# Altium schematic sheet peripherals.SchDoc: Peripherals
size C; Organization: Altium Limited; Address1: L3, 12a Rodborough Rd; Address2: Frenchs Forest; Address3: NSW; Address4: Australia 2086; Revision: A; SheetNumber: 5; SheetTotal: 7
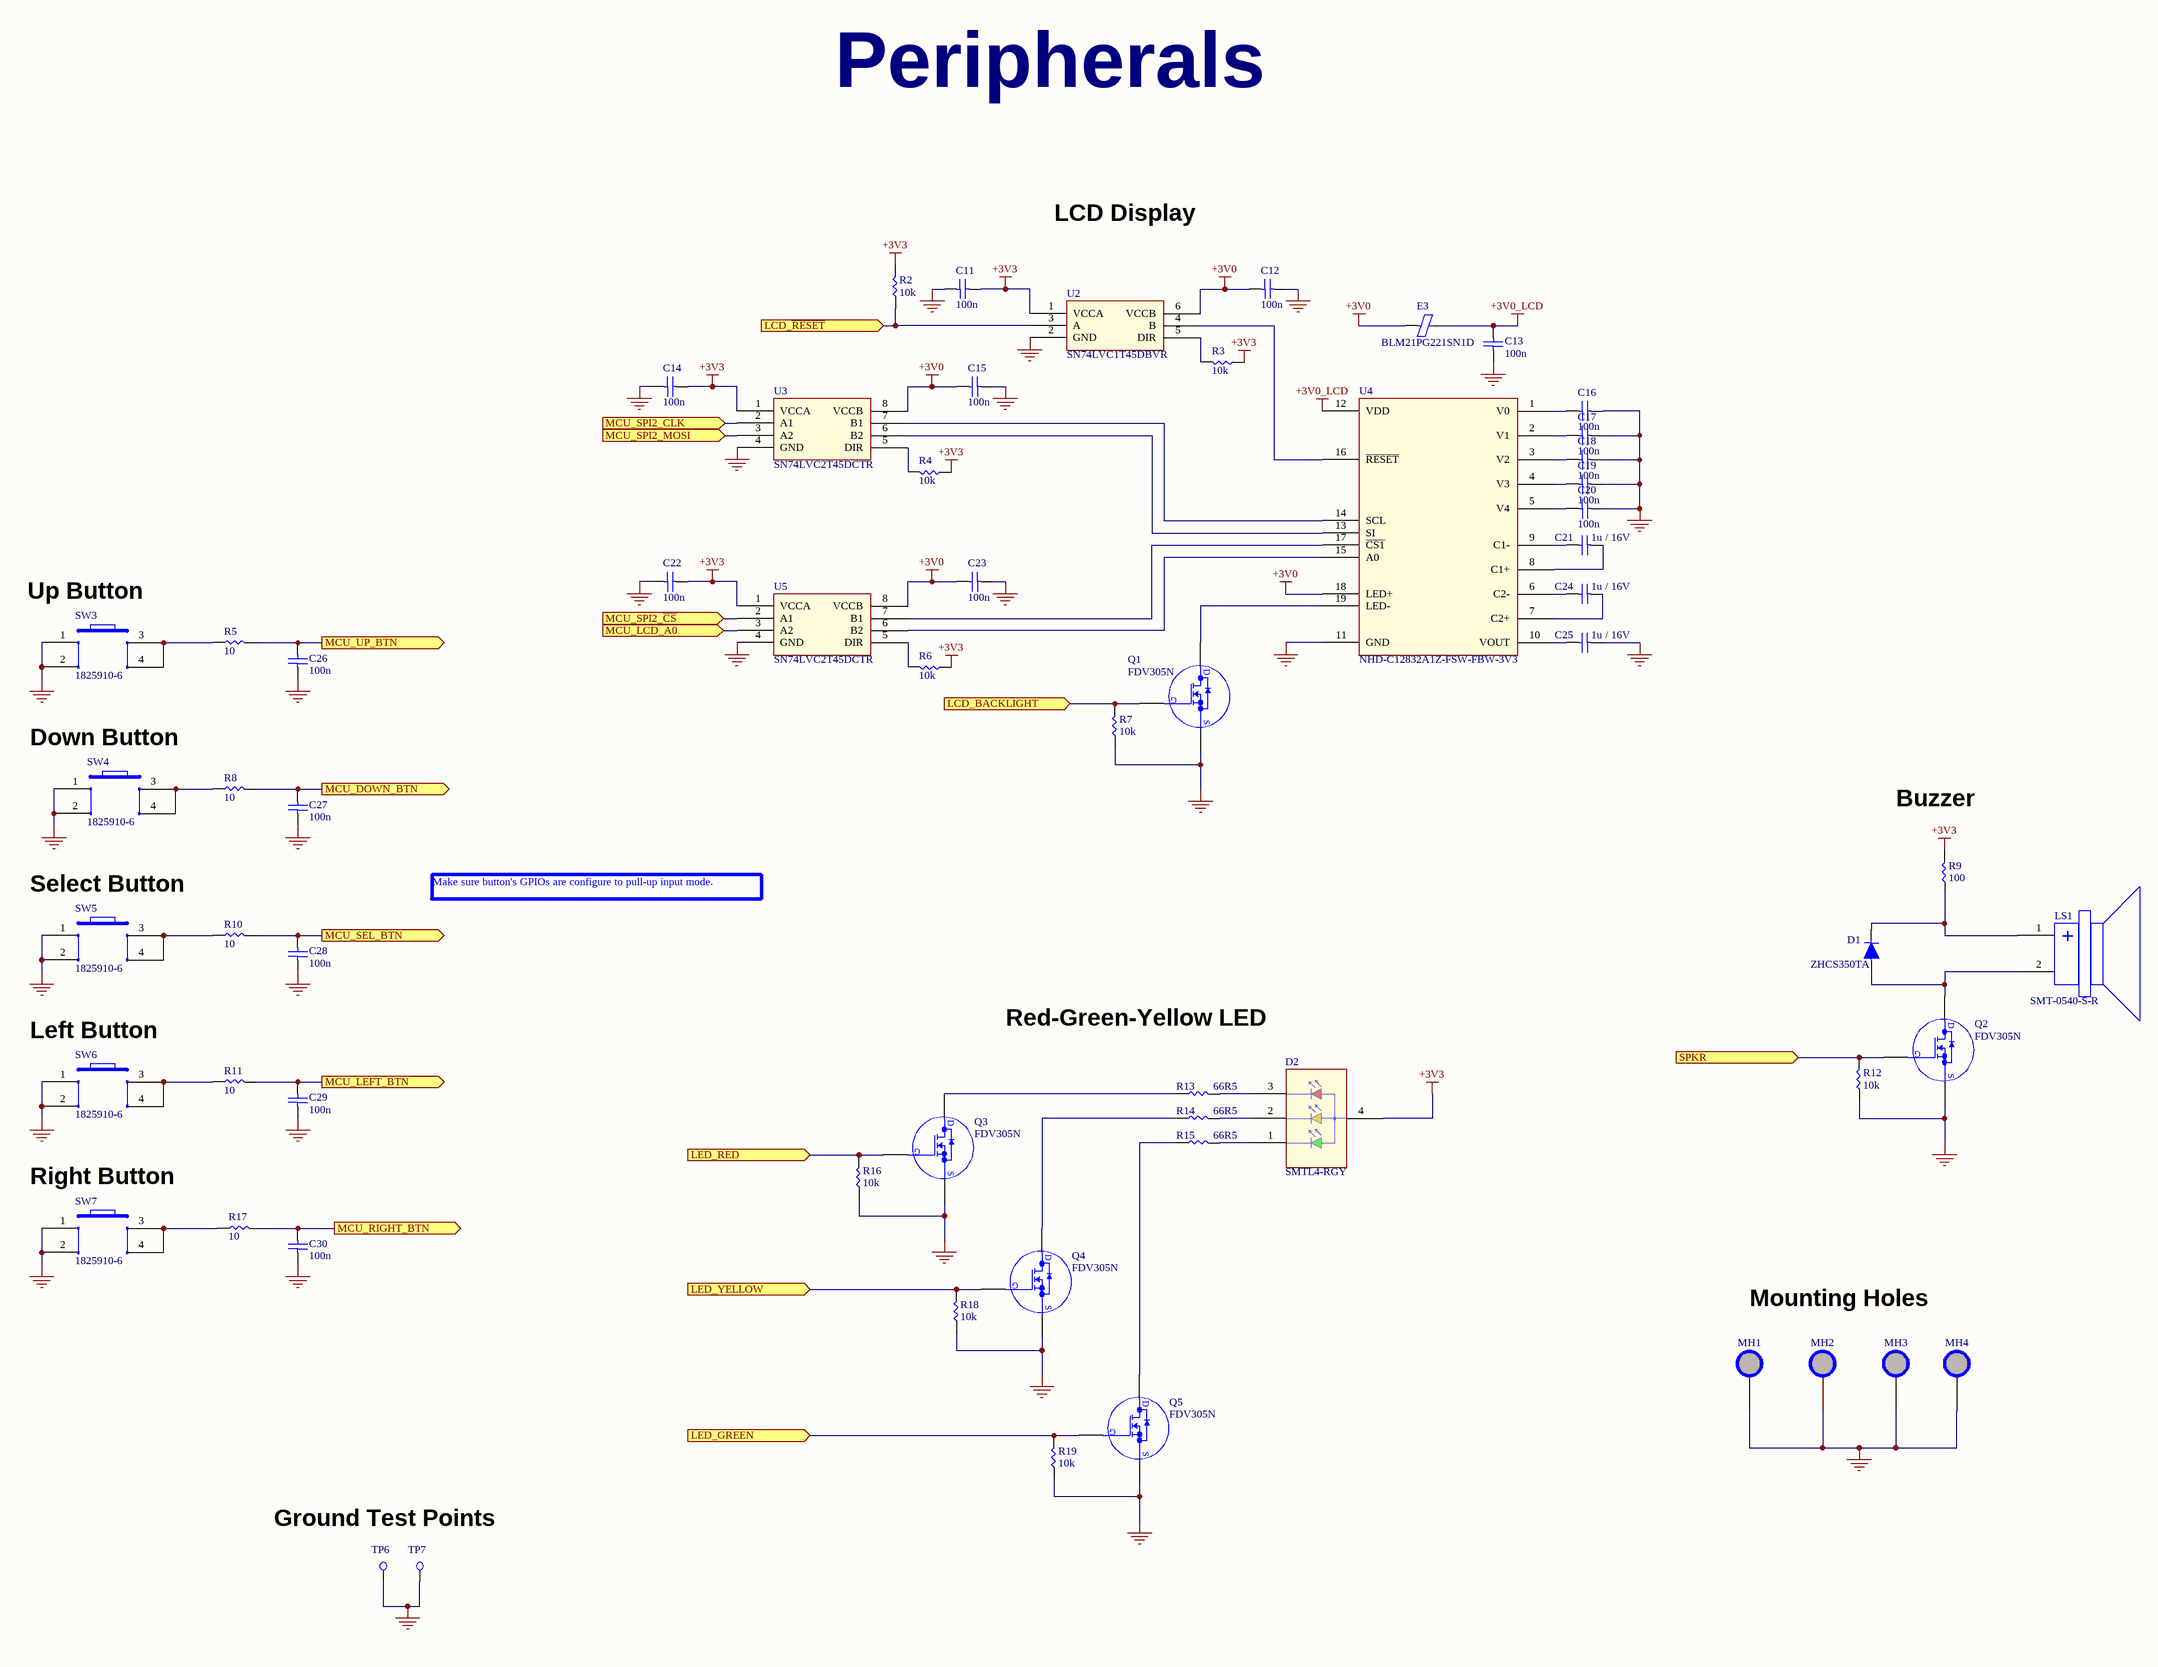
[diagram p0: peripherals.SchDoc]

## Parts
C11  100n  [C0402]
C12  100n  [C0402]
C13  100n  [C0402]
C14  100n  [C0402]
C15  100n  [C0402]
C16  100n  [C0402]
C17  100n  [C0402]
C18  100n  [C0402]
C19  100n  [C0402]
C20  100n  [C0402]
C21  1u / 16V  [C0805]
C22  100n  [C0402]
C23  100n  [C0402]
C24  1u / 16V  [C0805]
C25  1u / 16V  [C0805]
C26  100n  [C0402]
C27  100n  [C0402]
C28  100n  [C0402]
C29  100n  [C0402]
C30  100n  [C0402]
D1  ZHCS350TA  [DIODE_SOD-523]
D2  SMTL4-RGY  [SMTL4-RGY]
E3  BLM21PG221SN1D  [R0805]
LS1  SMT-0540-S-R  [SMT-0540-S-R]
MH1  Mounting Hole 7.4mm, 3.2mm  [MH_7.4mm_3.2mm]  (value not drawn)  (no BOM)
MH2  Mounting Hole 7.4mm, 3.2mm  [MH_7.4mm_3.2mm]  (value not drawn)  (no BOM)
MH3  Mounting Hole 7.4mm, 3.2mm  [MH_7.4mm_3.2mm]  (value not drawn)  (no BOM)
MH4  Mounting Hole 7.4mm, 3.2mm  [MH_7.4mm_3.2mm]  (value not drawn)  (no BOM)
Q1  FDV305N  [FDV305N_SOT-23-3]
Q2  FDV305N  [FDV305N_SOT-23-3]
Q3  FDV305N  [FDV305N_SOT-23-3]
Q4  FDV305N  [FDV305N_SOT-23-3]
Q5  FDV305N  [FDV305N_SOT-23-3]
R2  10k  [R0805]
R3  10k  [R0805]
R4  10k  [R0805]
R5  10  [R0402]
R6  10k  [R0805]
R7  10k  [R0805]
R8  10  [R0402]
R9  100  [R0805]
R10  10  [R0402]
R11  10  [R0402]
R12  10k  [R0805]
R13  66R5  [R0805]
R14  66R5  [R0805]
R15  66R5  [R0805]
R16  10k  [R0805]
R17  10  [R0402]
R18  10k  [R0805]
R19  10k  [R0805]
SW3  1825910-6  [1825910-6]
SW4  1825910-6  [1825910-6]
SW5  1825910-6  [1825910-6]
SW6  1825910-6  [1825910-6]
SW7  1825910-6  [1825910-6]
TP6  Test Pad 1mm  [TP_1MM]  (value not drawn)  (no BOM)
TP7  Test Pad 1mm  [TP_1MM]  (value not drawn)  (no BOM)
U2  SN74LVC1T45DBVR  [SOT-23-6]
U3  SN74LVC2T45DCTR  [SOP8]
U4  NHD-C12832A1Z-FSW-FBW-3V3  [NHD-C12832A1Z-FSW-FBW-3V3]
U5  SN74LVC2T45DCTR  [SOP8]

## Ports
LCD_BACKLIGHT (in), LCD_~{RESET} (in), LED_GREEN (in), LED_RED (in), LED_YELLOW (in), MCU_DOWN_BTN (out), MCU_LCD_A0 (in), MCU_LEFT_BTN (out), MCU_RIGHT_BTN (out), MCU_SEL_BTN (out), MCU_SPI2_CLK (in), MCU_SPI2_MOSI (in), MCU_SPI2_~{CS} (in), MCU_UP_BTN (out), SPKR (in)

## Nets
+3V0: C12.1 C15.2 C23.2 E3.1 U2.6(VCCB) U3.8(VCCB) U4.18(LED+) U5.8(VCCB)
+3V0_LCD: C13.2 E3.2 U4.12(VDD)
+3V3: C11.2 C14.2 C22.2 D2.4(COMMON_ANODE) R2.2 R3.1 R4.1 R6.1 R9.2 U2.1(VCCA) U3.1(VCCA) U5.1(VCCA)
GND: C11.1 C12.2 C13.1 C14.1 C15.1 C16.2 C17.2 C18.2 C19.2 C20.2 C22.1 C23.1 C25.1 C26.1 C27.1 C28.1 C29.1 C30.1 MH1.1 MH2.1 MH3.1 MH4.1 Q1.2(S) Q2.2(S) Q3.2(S) Q4.2(S) Q5.2(S) R7.1 R12.1 R16.1 R18.1 R19.1 SW3.1 SW3.2 SW4.1 SW4.2 SW5.1 SW5.2 SW6.1 SW6.2 SW7.1 SW7.2 TP6.1 TP7.1 U2.2(GND) U3.4(GND) U4.11(GND) U5.4(GND)
LCD_BACKLIGHT: Q1.1(G) R7.2 ; port LCD_BACKLIGHT
LCD_~{RESET}: R2.1 U2.3(A) ; port LCD_~{RESET}
LED_GREEN: Q5.1(G) R19.2 ; port LED_GREEN
LED_RED: Q3.1(G) R16.2 ; port LED_RED
LED_YELLOW: Q4.1(G) R18.2 ; port LED_YELLOW
MCU_DOWN_BTN: C27.2 R8.2 ; port MCU_DOWN_BTN
MCU_LCD_A0: U5.3(A2) ; port MCU_LCD_A0
MCU_LEFT_BTN: C29.2 R11.2 ; port MCU_LEFT_BTN
MCU_RIGHT_BTN: C30.2 R17.2 ; port MCU_RIGHT_BTN
MCU_SEL_BTN: C28.2 R10.2 ; port MCU_SEL_BTN
MCU_SPI2_~{CS}: U5.2(A1) ; port MCU_SPI2_~{CS}
MCU_SPI2_CLK: U3.2(A1) ; port MCU_SPI2_CLK
MCU_SPI2_MOSI: U3.3(A2) ; port MCU_SPI2_MOSI
MCU_UP_BTN: C26.2 R5.2 ; port MCU_UP_BTN
SPKR: Q2.1(G) R12.2 ; port SPKR
NetC16_1: C16.1 U4.1(V0)
NetC17_1: C17.1 U4.2(V1)
NetC18_1: C18.1 U4.3(V2)
NetC19_1: C19.1 U4.4(V3)
NetC20_1: C20.1 U4.5(V4)
NetC21_1: C21.1 U4.8(C1+)
NetC21_2: C21.2 U4.9(C1-)
NetC24_1: C24.1 U4.7(C2+)
NetC24_2: C24.2 U4.6(C2-)
NetC25_2: C25.2 U4.10(VOUT)
NetD1_1: D1.1(A) LS1.2(+) Q2.3(D)
NetD1_2: D1.2(K) LS1.1(+) R9.1
NetD2_1: D2.1(GREEN_CATHODE) R15.2
NetD2_2: D2.2(YELLOW_CATHODE) R14.2
NetD2_3: D2.3(RED_CATHODE) R13.2
NetQ1_3: Q1.3(D) U4.19(LED-)
NetQ3_3: Q3.3(D) R13.1
NetQ4_3: Q4.3(D) R14.1
NetQ5_3: Q5.3(D) R15.1
NetR3_2: R3.2 U2.5(DIR)
NetR4_2: R4.2 U3.5(DIR)
NetR5_1: R5.1 SW3.3 SW3.4
NetR6_2: R6.2 U5.5(DIR)
NetR8_1: R8.1 SW4.3 SW4.4
NetR10_1: R10.1 SW5.3 SW5.4
NetR11_1: R11.1 SW6.3 SW6.4
NetR17_1: R17.1 SW7.3 SW7.4
NetU2_4: U2.4(B) U4.16(~{RESET})
NetU3_6: U3.6(B2) U4.13(SI)
NetU3_7: U3.7(B1) U4.14(SCL)
NetU4_15: U4.15(A0) U5.6(B2)
NetU4_17: U4.17(~{CS1}) U5.7(B1)

## Notes on the sheet
- Peripherals
- LCD Display
- (near SW3) Up Button
- Down Button
- Buzzer
- Select Button
- Make sure button's GPIOs are configure to pull-up input mode.
- Left Button
- Red-Green-Yellow LED
- Right Button
- Mounting Holes
- Ground Test Points
- Title:
- Size:
- Date:
- File:
- C
- Number:
- Revision:
- Sheet
- of
- https://github.com/barakgut
- Github:

## Library data of the parts
C11-C20 C22 C23 C26-C30 = CGA2B3X7R1E104K050BB: TDK         CGA2B3X7R1E104K050BB             SMD Multilayer Ceramic Capacitor, 0402 [1005 Metric], 0.1 F, 25 V,  10%, X7R, CGA Series; PCN Part Number: MLCC Part Number Change 30/Nov/2012; Capacitance: 0.1µF; Product Training Modules: CGA Series for Automotive Applications SEAT, CCV, and TVCL Design Tools Guide to Replacing an Electrolytic Capacitor with an MLCC; Featured Product: CGA Series MLCC Capacitors; Voltage - Rated: 25V; Online Catalog: CGA Series, Automotive General, Mid and High Voltage; Other Names: 445-6902-6; Supplier 1: Digi-Key; Supplier Part Number 1: 445-6902-1-ND; Manufacturer: TDK; Stock 1: 100000; Pricing 1: 1=0.16, 10=0.115, 100=0.054, 500=0.0379, 1000=0.0314, 2500=0.0292, 5000=0.0267 (USD); Package / Case: 0402 (1005 Metric); Packaging: Digi-Reel®; RoHS Information: RoHS Certificate-MLCC; Standard Package: 1; Category: Capacitors; Family: Ceramic Capacitors; Series: CGA; Tolerance: ±10%; Temperature Coefficient: X7R; Mounting Type: Surface Mount, MLCC; Operating Temperature: -55°C ~ 125°C; Applications: Automotive; Ratings: AEC-Q200; Size / Dimension: 0.039" L x 0.020" W (1.00mm x 0.50mm); Height - Seated (Max): -; Thickness (Max): 0.022" (0.55mm); Lead Spacing: -; Features: -; Lead Style: -; ComponentLink1URL: http://www.farnell.com/datasheets/1735392.pdf; ComponentLink1Description: http://www.farnell.com/datasheets/1735392.pdf; ComponentLink2URL: http://www.mouser.com/ds/2/400/lcc_automotive_general_en-843974.pdf; ComponentLink2Description: http://www.mouser.com/ds/2/400/lcc_automotive_general_en-843974.pdf; Manufacturer Part Number: CGA2B3X7R1E104K050BB
C21 C24 C25 = C0805C105K4RAC7800: Multilayer Ceramic Capacitors MLCC - SMD/SMT 16volts 1uF X7R 10%; Manufacturer: KEMET; Rad Hard: No; Voltage: 16 Vdc; Product Length: 2 mm; Product Height: 0.9 mm; Product Depth: 1.25 mm; Supplier 1: Digi-Key; Supplier Part Number 1: 399-1284-1-ND; Stock 1: 40000; Pricing 1: 1=0.17, 10=0.124, 100=0.0581, 500=0.0408, 1000=0.0337 (USD); Package/Case: 0805; Mounting: Surface Mount; Capacitance Value: 1 uF; Tolerance: 10 %; Dielectric: X7R; Operating Temperature: -55 to 125 °C; Construction: Flat; Category: Capacitor Ceramic Multilayer; Manufacturer Part Number: C0805C105K4RAC7800
D1 = ZHCS350TA: DIODE SCHOTTKY 40V 350MA SOD523; Manufacturer: Diodes Zetex; If - Forward Current: 0.51 A; Vf - Forward Voltage: 0.81 V at 0.35 A; Ifsm - Forward Surge Current: 4.2 A; Configuration: Single; Ir - Reverse Current: 12 uA at 30 V; Brand: Diodes Incorporated; trr - Reverse Recovery time: 1.6 ns; Type: Schottky Diode; Unit Weight: 0.000035 oz; Supplier 1: Digi-Key; Supplier Part Number 1: ZHCS350TACT-ND; Stock 1: 263997; Pricing 1: 1=0.45, 10=0.382, 100=0.2855, 500=0.2243, 1000=0.1734 (USD); Product Category: Schottky Diodes & Rectifiers; RoHS: True; Product: Schottky Diodes; Mounting Style: SMD/SMT; Package / Case: SOD-523; Vrrm - Repetitive Reverse Voltage: 40 V; Technology: Si; Maximum Operating Temperature: + 125 C; Minimum Operating Temperature: - 55 C; Series: ZHCS350; Packaging: Reel; Height: 0.8 mm; Length: 1.3 mm; Operating Temperature Range: + 125 C; Factory Pack Quantity: 3000; Termination Style: SMD/SMT; Width: 0.9 mm; ComponentLink1URL: http://www.farnell.com/datasheets/2238072.pdf; ComponentLink1Description: http://www.farnell.com/datasheets/2238072.pdf; ComponentLink2URL: http://www.diodes.com/datasheets/ZHCS350.pdf; ComponentLink2Description: http://www.diodes.com/datasheets/ZHCS350.pdf; ComponentLink3URL: http://www.farnell.com/datasheets/13262.pdf; ComponentLink3Description: http://www.farnell.com/datasheets/13262.pdf; ComponentLink4URL: http://www.diodes.com///datasheets/ZHCS350.pdf; ComponentLink4Description: http://www.diodes.com///datasheets/ZHCS350.pdf; ComponentLink5URL: https://www.diodes.com/assets/Datasheets/ZHCS350.pdf; ComponentLink5Description: https://www.diodes.com/assets/Datasheets/ZHCS350.pdf; ComponentLink6URL: http://www.mouser.com/ds/2/115/ZHCS350-93341.pdf; ComponentLink6Description: http://www.mouser.com/ds/2/115/ZHCS350-93341.pdf; Manufacturer Part Number: ZHCS350TA
D2 = SMTL4-RGY: Green, Red, Yellow 570nm Green, 640nm Red, 585nm Yellow LED Indication - Discrete 1.9V Green, 1.85V Red, 1.9V Yellow 4-PLCC; Manufacturer: Bivar; Lens Color: Colorless; Lens Transparency: Clear; Millicandela Rating: 40mcd Green, 36mcd Red, 16mcd Yellow; Lens Style/Size: Round with Flat Top, 2.40mm; Current - Test: 20mA Green, 20mA Red, 20mA Yellow; Viewing Angle: 120°; Supplier 1: Digi-Key; Supplier Part Number 1: 492-2173-1-ND; Stock 1: 53898; Pricing 1: 1=1.65, 10=1.338, 25=1.0296, 100=0.9266, 250=0.8237, 500=0.7001, 1000=0.5766 (USD); Category: Optoelectronics; Family: LED Indication - Discrete; Series: -; Packaging: Tape & Reel (TR); Part Status: Active; Color: Green, Red, Yellow; Voltage - Forward (Vf) (Typ): 1.9V Green, 1.85V Red, 1.9V Yellow; Mounting Type: Surface Mount; Wavelength - Dominant: 570nm Green, 640nm Red, 585nm Yellow; Wavelength - Peak: -; Features: -; Package / Case: 4-PLCC; Supplier Device Package: 4-PLCC; Size / Dimension: 3.20mm L x 2.80mm W; Height (Max): 2.05mm; Manufacturer Part Number: SMTL4-RGY
E3 = BLM21PG221SN1D: FERRITE CHIP 220 OHM 0805; Manufacturer: Murata; Product Training Modules: Ferrite Beads and Arrays; Catalog Drawings: BLM21 Series Side BLM21 Series Top; EDA / CAD Models: Download from Accelerated Designs; Filter Type: Power Line; Number of Lines: 1; Impedance @ Frequency: 220 Ohm @ 100MHz; Current Rating (Max): 2A; DC Resistance (DCR) (Max): 45 mOhm; Online Catalog: EMIFIL® BLM21P Series; Other Names: 490-1054-6; Supplier 1: Digi-Key; Supplier Part Number 1: 490-1054-1-ND; Stock 1: 1796179; Pricing 1: 1=0.1, 10=0.081, 25=0.0732, 50=0.0538, 100=0.0464, 250=0.0366, 500=0.0309, 1000=0.0261 (USD); Standard Package: 1; Category: Filters; Family: Ferrite Beads and Chips; Series: BLM21P; Packaging: Digi-Reel®; Ratings: -; Operating Temperature: -55°C ~ 125°C; Package / Case: 0805 (2012 Metric); Mounting Type: Surface Mount; Height (Max): 0.041" (1.05mm); Size / Dimension: 0.079" L x 0.049" W (2.00mm x 1.25mm); Manufacturer Part Number: BLM21PG221SN1D
LS1 = SMT-0540-S-R: BUZZER MAGNETIC 3V 5MM SMD; Manufacturer: Projects Unlimited; Frequency: 4 kHz; Sound Pressure Level: 78 dBA; Shape: Square; Brand: PUI Audio; Supplier 1: Digi-Key; Supplier Part Number 1: 668-1060-1-ND; Stock 1: 22701; Pricing 1: 1=3.13, 10=2.476, 25=2.2596, 50=2.1106, 100=1.9619, 250=1.7995, 500=1.6913 (USD); Product Category: Speakers & Transducers; RoHS: True; Product: Transducers; Type: Electromagnetic; Termination Style: Gullwing Lead; Length: 5 mm; Width: 5 mm; Depth: 2 mm; Length - in: 0.197 in; Length - mm: 5 mm; Operating Temperature Range: - 40 C to + 85 C; Packaging: Reel; Factory Pack Quantity: 2000; Width - in: 0.197 in; Width - mm: 5 mm; ComponentLink1URL: http://www.mouser.com/ds/2/334/SMT-0540-S-R-44003.pdf; ComponentLink1Description: http://www.mouser.com/ds/2/334/SMT-0540-S-R-44003.pdf; ComponentLink2URL: http://www.puiaudio.com/pdf/SMT-0540-S-R.pdf; ComponentLink2Description: http://www.puiaudio.com/pdf/SMT-0540-S-R.pdf; ComponentLink3URL: http://www.farnell.com/datasheets/1916494.pdf; ComponentLink3Description: http://www.farnell.com/datasheets/1916494.pdf; Manufacturer Part Number: SMT-0540-S-R
MH1-MH4 = MOUNT_HOLE_7.4mm_3.2mm
Q1-Q5 = FDV305N: MOSFET N-CH 20V 0.9A SOT-23; Manufacturer: ON Semiconductor / Fairchild; Channel Type: N; Maximum Drain Source Resistance: 0.22 Ω; Minimum Gate Threshold Voltage: 0.6V; Maximum Gate Source Voltage: ±12 V; Transistor Configuration: Single; Channel Mode: Enhancement; Maximum Power Dissipation: 0.35 W; Typical Gate Charge @ Vgs: 1.1 nC @ 4.5 V; Typical Turn-Off Delay Time: 8 ns; Number of Elements per Chip: 1; Transistor Material: Si; Typical Turn-On Delay Time: 4.5 ns; Typical Input Capacitance @ Vds: 109 pF@ 10 V; Supplier 1: Digi-Key; Supplier Part Number 1: FDV305NCT-ND; Stock 1: 113719; Pricing 1: 1=0.43, 10=0.341, 100=0.234, 500=0.1604, 1000=0.1203 (USD); Maximum Continuous Drain Current: 0.9 A; Maximum Drain Source Voltage: 20 V; Package Type: SOT-23; Mounting Type: Surface Mount; Pin Count: 3; Category: Power MOSFET; Maximum Operating Temperature: +150 °C; Length: 2.92mm; Dimensions: 2.92 x 1.3 x 0.93mm; Width: 1.3mm; Minimum Operating Temperature: -55 °C; Height: 0.93mm; ComponentLink1URL: http://www.jameco.com/Jameco/Products/ProdDS/899087.pdf; ComponentLink1Description: http://www.jameco.com/Jameco/Products/ProdDS/899087.pdf; ComponentLink2URL: http://www.mouser.com/ds/2/149/FDV305N-79611.pdf; ComponentLink2Description: http://www.mouser.com/ds/2/149/FDV305N-79611.pdf; ComponentLink3URL: https://www.fairchildsemi.com/package-drawings/MA/MA03B.pdf; ComponentLink3Description: https://www.fairchildsemi.com/package-drawings/MA/MA03B.pdf; ComponentLink4URL: http://www.farnell.com/datasheets/184807.pdf; ComponentLink4Description: http://www.farnell.com/datasheets/184807.pdf; ComponentLink5URL: http://www.fairchildsemi.com/ds/FD/FDV305N.pdf; ComponentLink5Description: http://www.fairchildsemi.com/ds/FD/FDV305N.pdf; ComponentLink6URL: https://www.fairchildsemi.com/datasheets/FD/FDV305N.pdf; ComponentLink6Description: https://www.fairchildsemi.com/datasheets/FD/FDV305N.pdf; Manufacturer Part Number: FDV305N
R2-R4 R6 R7 R12 R16 R18 R19 = RC0805FR-0710KL: RES SMD 10K OHM 1% 1/8W 0805; Manufacturer: Yageo; Resistance: 10 kOhms; Power Rating: 125 mW (1/8 W); Voltage Rating: 150 V; Temperature Coefficient: 100 PPM / C; Supplier 1: Digi-Key; Supplier Part Number 1: 311-10.0KCRCT-ND; Stock 1: 31531286; Pricing 1: 1=0.1, 10=0.046, 100=0.0186, 1000=0.0084, 2500=0.0073 (USD); Termination Style: SMD/SMT; Product: Thick Film Resistors General Purpose; Tolerance: 1 %; Case Code - in: 0805; Case Code - mm: 2012; Series: RC; Operating Temperature Range: - 55 C to + 155 C; Packaging: Reel; Manufacturer Part Number: RC0805FR-0710KL
R5 R8 R10 R11 R17 = RC0402FR-0710RL: RES SMD 10 OHM 1% 1/16W 0402; Manufacturer: Yageo; Resistance: 10 Ohms; Power Rating: 62.5 mW (1/16 W); Temperature Coefficient: 100 PPM / C; Voltage Rating: 50 V; Supplier 1: Digi-Key; Supplier Part Number 1: 311-10.0LRCT-ND; Stock 1: 1306139; Pricing 1: 1=0.1, 10=0.027, 100=0.0111, 1000=0.005, 2500=0.0043, 5000=0.0036 (USD); Case Code - in: 0402; Case Code - mm: 1005; Operating Temperature Range: - 55 C to + 155 C; Packaging: Reel; Product: Thick Film Resistors General Purpose; Series: RC; Termination Style: SMD/SMT; Tolerance: 1 %; Manufacturer Part Number: RC0402FR-0710RL; ComponentLink1URL: http://www.farnell.com/datasheets/1018594.pdf; ComponentLink1Description: http://www.farnell.com/datasheets/1018594.pdf; ComponentLink2URL: https://www.verical.com/server-webapp/html/getDatasheet?partID=323697; ComponentLink2Description: https://www.verical.com/server-webapp/html/getDatasheet?partID=323697
R9 = RT0805FRE07100RL: RES SMD 100 OHM 1% 1/8W 0805; Manufacturer: Yageo; Resistance: 100 Ohms; Power Rating: 125 mW (1/8 W); Temperature Coefficient: 50 PPM / C; Voltage Rating: 150 V; Unit Weight: 0.000194 oz; Supplier 1: Digi-Key; Supplier Part Number 1: YAG3360CT-ND; Stock 1: 7; Pricing 1: 1=0.11, 10=0.097, 100=0.0375, 1000=0.0165, 2500=0.0142 (USD); Product Category: Thin Film Resistors; RoHS: True; Brand: Yageo; Tolerance: 1 %; Case Code - in: 0805; Case Code - mm: 2012; Operating Temperature Range: - 55 C to + 125 C; Series: RT; Packaging: Reel; Height: 0.5 mm; Length: 2 mm; Package / Case: 0805 (2012 metric); Product: Thin Film Resistors SMD; Termination Style: SMD/SMT; Type: High Precision, High Stability; Width: 1.2 mm; ComponentLink1URL: http://www.yageo.com/NewPortal/yageodocoutput?fileName=/pdf/R-Chip/PYu-RT_1-to-0.05_RoHS_L_5.pdf; ComponentLink1Description: http://www.yageo.com/NewPortal/yageodocoutput?fileName=/pdf/R-Chip/PYu-RT_1-to-0.05_RoHS_L_5.pdf; ComponentLink2URL: http://www.mouser.com/ds/2/447/yageodocoutput-1125656.pdf; ComponentLink2Description: http://www.mouser.com/ds/2/447/yageodocoutput-1125656.pdf; ComponentLink3URL: http://www.farnell.com/datasheets/442970.pdf; ComponentLink3Description: http://www.farnell.com/datasheets/442970.pdf; Manufacturer Part Number: RT0805FRE07100RL
R13-R15 = RC0805FR-0766R5L: Thick Film Resistors - SMD 66.5 OHM 1%; Manufacturer: Yageo; Case Height: 0.5 mm; Case Length: 2 mm; Case Width: 1.25 mm; Power Rating: 125 mW (1/8 W); Resistance: 66.5 Ohms; Temperature Coefficient: 100 PPM / C; Voltage Rating: 150 V; Supplier 1: Digi-Key; Supplier Part Number 1: 311-66.5CRCT-ND; Stock 1: 162629; Pricing 1: 1=0.1, 10=0.056, 100=0.0228, 1000=0.0102, 2500=0.0089 (USD); Brand: Yageo; Case Code - in: 0805; Case Code - mm: 2012; Dimensions: 1.25 mm W x 2 mm L x 0.5 mm H; Product Category: Thick Film Resistors - SMD; Operating Temperature Range: - 55 C to + 155 C; Package / Case: 0805 (2012 metric); Packaging: Reel; Product: Thick Film Resistors General Purpose; Termination Style: SMD/SMT; RoHS: Details; Tolerance: 1 %; Series: RC; Type: General Purpose Chip Resistor Surface Mount; Manufacturer Part Number: RC0805FR-0766R5L
SW3-SW7 = 1825910-6: Switch Push Button OFF (ON) SPST Round Button 0.05A 24VDC Momentary Contact PC Pins Thru-Hole; Manufacturer: TE Connectivity Alcoswitch; Actuator Color: Black; Actuator Length: 1.4 mm; Actuator Material: Polybutylene Terephthalate; Body Orientation: Straight; Bushing Type: Unthreaded; Electrical Life: 100000 Cycles; Dielectric Strength: 500 VAC; Contact Rating @ Voltage: 0.05A@24VDC; Maximum DC Voltage Rating: 24 V; Maximum Contact Resistance: 100 mOhm; Illumination: N/R; Supplier 1: Digi-Key; Supplier Part Number 1: 450-1650-ND; Stock 1: 75696; Pricing 1: 1=0.1, 10=0.093, 25=0.0892, 50=0.0862, 100=0.0814, 250=0.0766, 500=0.0734, 1000=0.0558, 5000=0.0463 (USD); Base Material: N/A; Actuator Style: Round Button; Family: 1825910; Contact Material: Copper Alloy; Contact Plating: Silver; Dimension: 5.99 x 5 mm; Part No: 1825910-6; RoHS: Yes; Function: Momentary Contact; Maximum AC Voltage Rating: N/A; Pole Throw Configuration: SPST; Mechanical Life: 100000 Cycles; Packaging: N/A; Housing Material: N/A; Product Weight: N/A; Mounting: Through Hole; Minimum Insulation Resistance: 100 MOhm; Operating Temperature: -35 to 85 C; Terminal Type: PC Pins; Seal Description: N/A; Switch Configuration: OFF (ON); Seal Location: N/A; Thread Size: N/R; Manufacturer Part Number: 1825910-6
TP6 TP7 = TEST_PAD_1mm
U2 = SN74LVC1T45DBVR: TEXAS INSTRUMENTS   SN74LVC1T45DBVR   Transceiver, Non-Inverting, 3-State, 1 Input, 1.65V to 5.5V, SOT-23-6; Additional Features: W/Volt Translation; DELETED: Compliant; High Level Output Current: -32 mA; Input Logic Level: LVTTL; Logic Family: LVC; Low Level Output Current: 32 mA; Number of  Elements: 1; Operating Supply Voltage (Typ): 1.8/2.5/3.3/5 V; Propagation Delay Time: 36.2 ns; Quiescent Current: 3 uA; Rad Hardened: No; Supplier 1: Digi-Key; Supplier Part Number 1: 296-16843-1-ND; Manufacturer: Texas Instruments; Stock 1: 138438; Pricing 1: 1=0.6, 10=0.51, 100=0.3807, 500=0.2991, 1000=0.2311 (USD); Mounting: Surface Mount; Number of Channels: 1; Operating Supply Voltage (Max): 5.5 V; Operating Supply Voltage (Min): 1.65 V; Operating Temp Range: -40C to 85C; Operating Temperature (Max): 85C; Operating Temperature (Min): -40C; Operating Temperature Classification: Industrial; Output Logic Level: LVTTL; Output Type: 3-State; Package Type: SOT-23; Packaging: Tape and Reel; Pin Count: 6; Polarity: Non-Inverting; Technology: CMOS; ComponentLink1URL: http://www.jameco.com/Jameco/Products/ProdDS/2000549.pdf; ComponentLink1Description: http://www.jameco.com/Jameco/Products/ProdDS/2000549.pdf; ComponentLink2URL: https://www.verical.com/server-webapp/html/getDatasheet?partID=309359; ComponentLink2Description: https://www.verical.com/server-webapp/html/getDatasheet?partID=309359; ComponentLink3URL: http://www.ti.com/lit/ds/symlink/sn74lvc1t45.pdf; ComponentLink3Description: http://www.ti.com/lit/ds/symlink/sn74lvc1t45.pdf; ComponentLink4URL: http://focus.ti.com/lit/ds/symlink/sn74lvc1t45.pdf; ComponentLink4Description: http://focus.ti.com/lit/ds/symlink/sn74lvc1t45.pdf; Manufacturer Part Number: SN74LVC1T45DBVR
U3 U5 = SN74LVC2T45DCTR: IC, 2BIT BUS TRANSCEIVER, SSOP-8; Manufacturer: Texas Instruments; Propagation Delay Time: 45.2ns; Number of  Elements: 1; Number of Channels: 2; Input Logic Level: LVTTL/TTL; Output Logic Level: LVCMOS; Polarity: Non-Inverting; Additional Features: W/Volt Translation; Logic Family: LVC; Logical Function: Voltage Level Translator; High Level Output Current: -32mA; Low Level Output Current: 32mA; Output Type: 3-State; Operating Supply Voltage (Typ): 1.8/2.5/3.3/5V; Quiescent Current: 3uA; Operating Supply Voltage (Max): 5.5V; Operating Supply Voltage (Min): 1.65V; Supplier 1: Digi-Key; Supplier Part Number 1: 296-16845-1-ND; Stock 1: 236711; Pricing 1: 1=0.61, 10=0.537, 100=0.4117, 500=0.3255, 1000=0.2604 (USD); Operating Temp Range: -40C to 85C; Technology: CMOS; Package Type: SSOP; Packaging: Tape and Reel; Mounting: Surface Mount; Pin Count: 8; Operating Temperature (Min): -40C; Operating Temperature (Max): 85C; Operating Temperature Classification: Industrial; ComponentLink1URL: http://www.ti.com/lit/ds/symlink/sn74lvc2t45.pdf; ComponentLink1Description: http://www.ti.com/lit/ds/symlink/sn74lvc2t45.pdf; ComponentLink2URL: http://www.jameco.com/Jameco/Products/ProdDS/1046748.pdf; ComponentLink2Description: http://www.jameco.com/Jameco/Products/ProdDS/1046748.pdf; ComponentLink3URL: https://www.verical.com/server-webapp/html/getDatasheet?partID=190128; ComponentLink3Description: https://www.verical.com/server-webapp/html/getDatasheet?partID=190128; ComponentLink4URL: http://www.ti.com/general/docs/lit/getliterature.tsp?genericPartNumber=SN74LVC2T45&&fileType=pdf; ComponentLink4Description: http://www.ti.com/general/docs/lit/getliterature.tsp?genericPartNumber=SN74LVC2T45&&fileType=pdf; ComponentLink5URL: http://www.farnell.com/datasheets/1882347.pdf; ComponentLink5Description: http://www.farnell.com/datasheets/1882347.pdf; ComponentLink6URL: http://focus.ti.com/lit/ds/symlink/sn74lvc2t45.pdf; ComponentLink6Description: http://focus.ti.com/lit/ds/symlink/sn74lvc2t45.pdf; ComponentLink7URL: http://www.farnell.com/datasheets/1863620.pdf; ComponentLink7Description: http://www.farnell.com/datasheets/1863620.pdf; Manufacturer Part Number: SN74LVC2T45DCTR
U4 = NHD-C12832A1Z-FSW-FBW-3V3: LCD COG GRAPHIC 128X32; Manufacturer: Newhaven Display; Active Area: 31.98x7.98 mm; Backlight: LED; Typical Contrast Ratio: 6:1; Pin_Count: 17; Display Mode: Transflective; Typical Response Time: 300 ms; Touchscreen: No; LCD Type: FSTN; COO: CN; Supplier 1: Newhaven Display; Supplier Part Number 1: NHD-C12832A1Z-FSW-FBW-3V3-ND; Stock 1: 6491; Pricing 1: 1=11, 5=10.34, 10=9.68, 50=9.13, 100=8.69, 250=8.25, 500=7.92 (USD); Part No: NHD-C12832A1Z-FSW-FBW-3V3; RoHS: Yes; Supplier Standard Pack: 100; Outline Dimensions: 41.4x24.3x4 mm; Family: NHD-C12832A1Z-FSW-FBW-3V3; Supplier_Package: N/A; Packaging: N/A; Display Color: N/A; Display Size: N/A; Mounting: Through Hole; Typical Brightness: N/A; Resolution Standard: N/A; Operating Temperature: -20 to 70 C; Dimension: 41.4 x 24.3 x 4.9mm; HTS: 8531200020; ECCN: EAR99; Manufacturer Part Number: NHD-C12832A1Z-FSW-FBW-3V3